# Altium project OAI_KPA_Power_Module.PrjPcb (part 2 of 2)

## Sheet Power module.SchDoc
size 410 x 297 mm
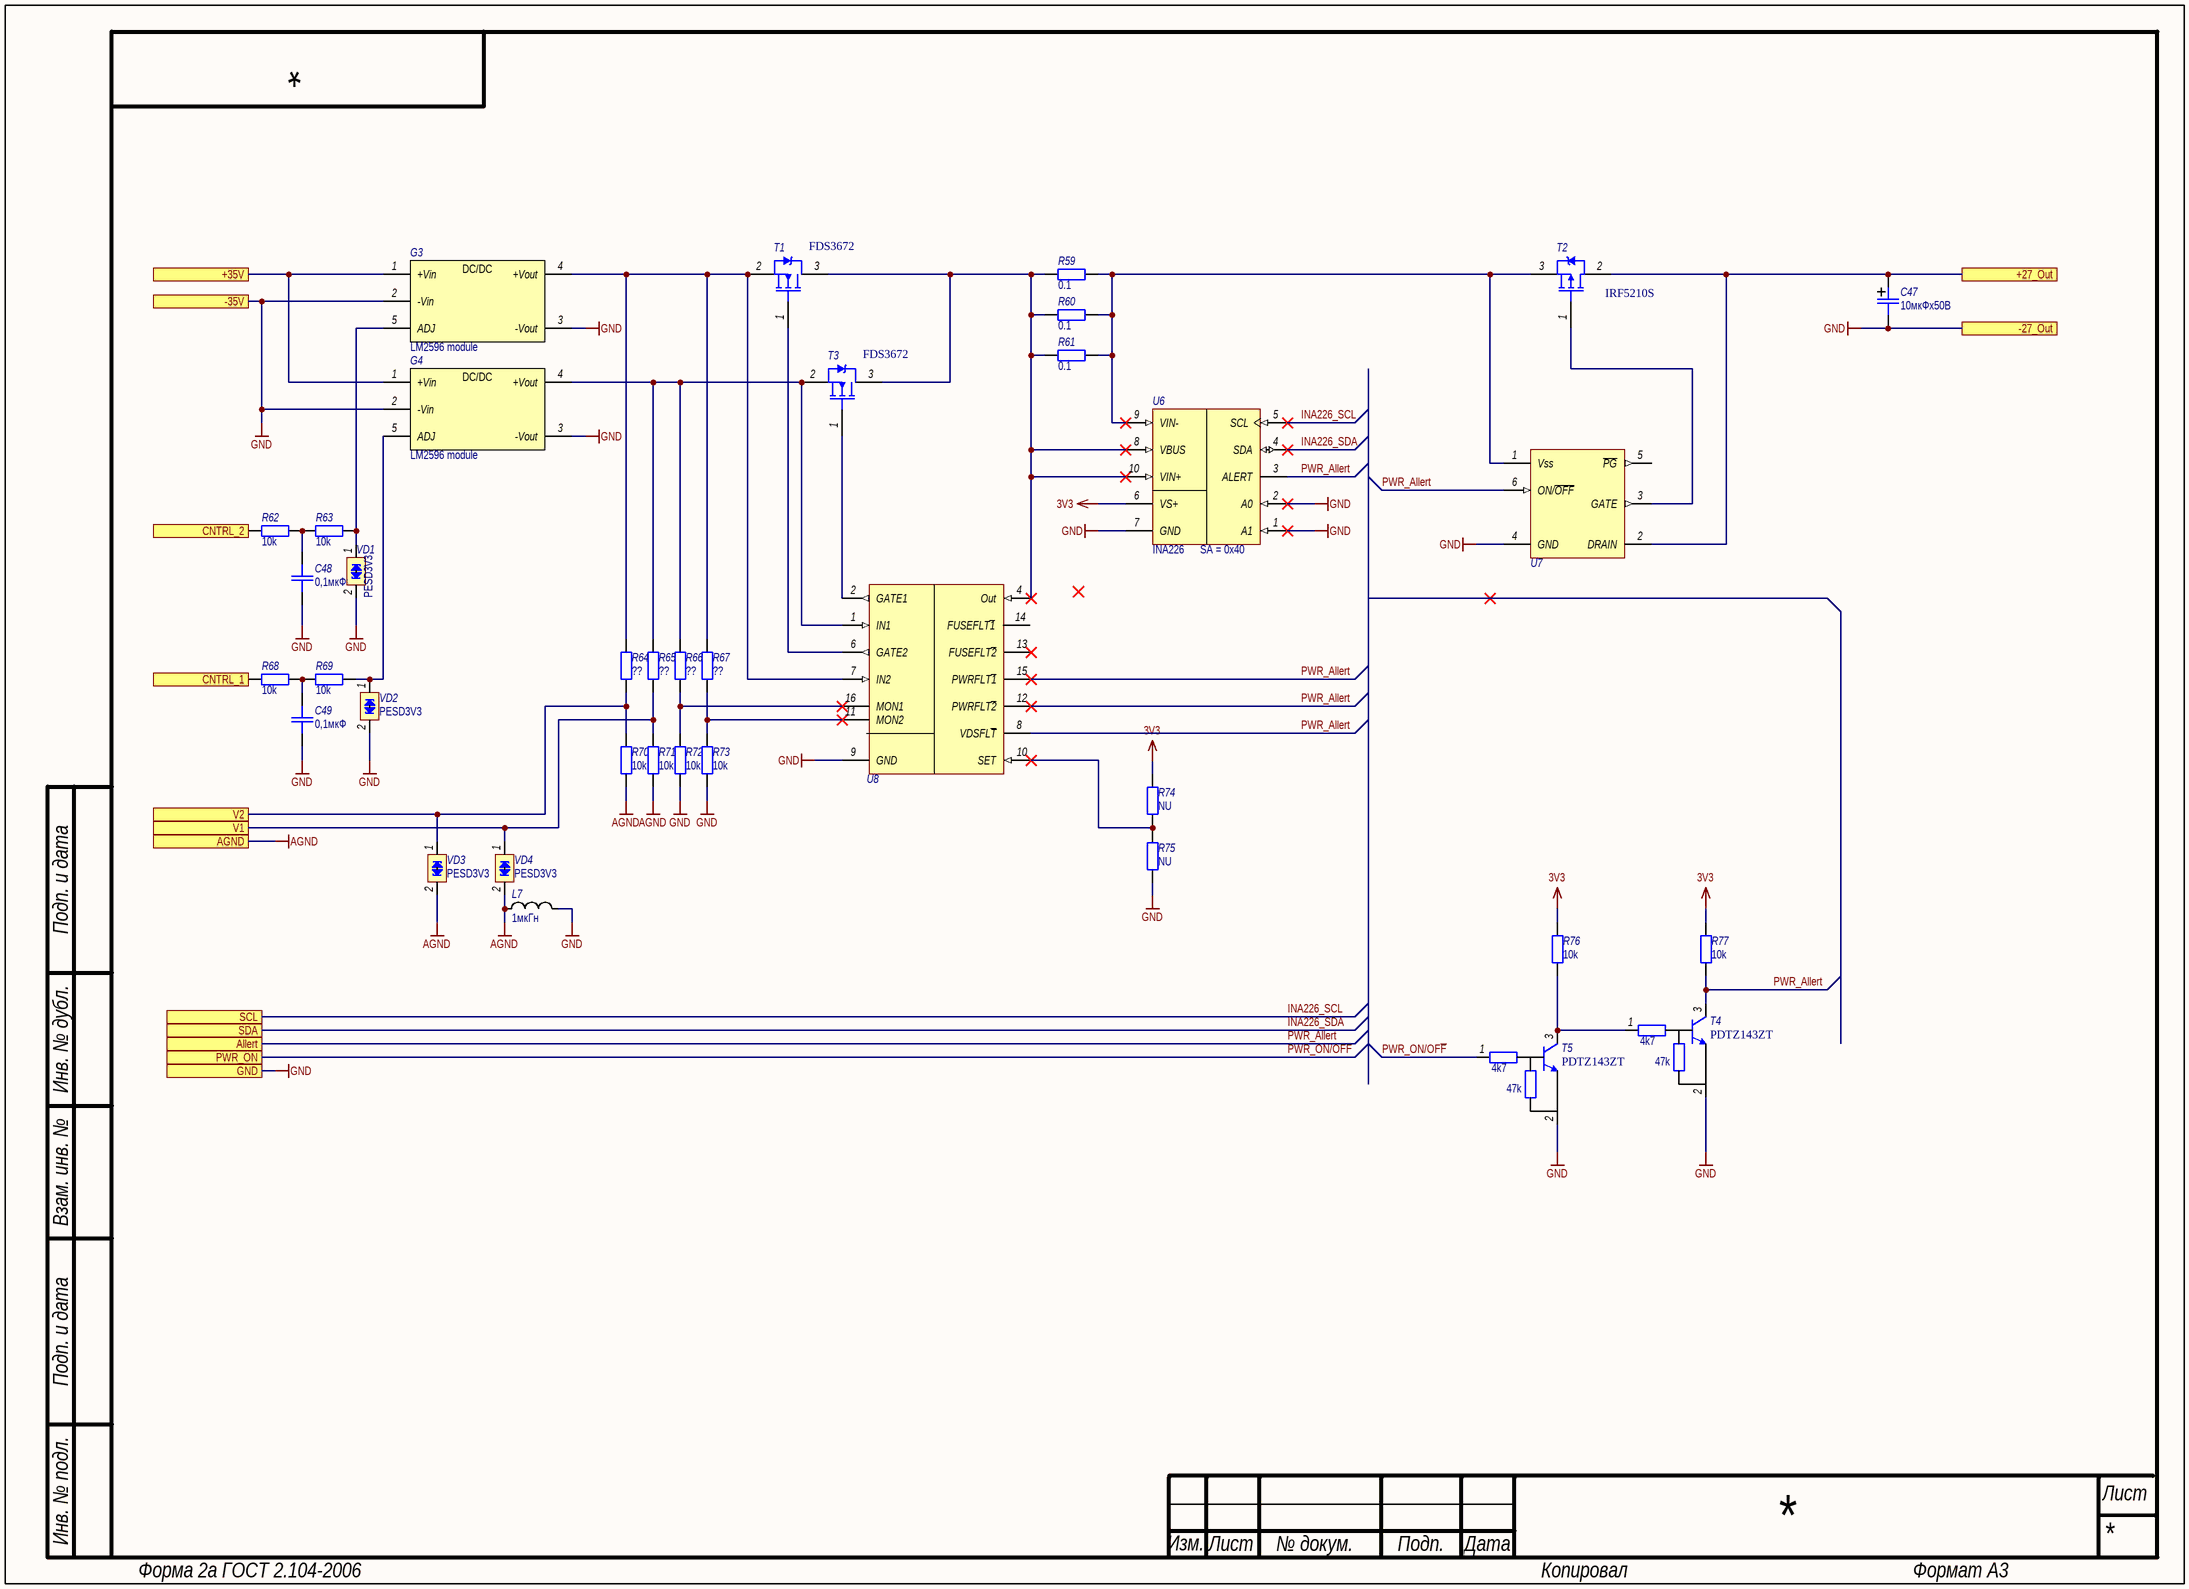
[diagram p8: Power module.SchDoc]

### Parts
C47  10мкФх50В  [SMD_size_C]
C48  0,1мкФ  [SMD_0805]
C49  0,1мкФ  [SMD_0805]
G3  LM2596  [LM2596 module]  (value not drawn)
G4  LM2596  [LM2596 module]  (value not drawn)
L7  1мкГн  [SMD_0805]
R59  0.1  [SMD_0805]
R60  0.1  [SMD_0805]
R61  0.1  [SMD_0805]
R62  10k  [SMD_0805]
R63  10k  [SMD_0805]
R64  ??  [SMD_0805]
R65  ??  [SMD_0805]
R66  ??  [SMD_0805]
R67  ??  [SMD_0805]
R68  10k  [SMD_0805]
R69  10k  [SMD_0805]
R70  10k  [SMD_0805]
R71  10k  [SMD_0805]
R72  10k  [SMD_0805]
R73  10k  [SMD_0805]
R74  NU  [SMD_0805]
R75  NU  [SMD_0805]
R76  10k  [SMD_0805]
R77  10k  [SMD_0805]
T1  FDS3672  [SO-8 Transistor]
T2  IRF5210S  [D2Pak]
T3  FDS3672  [SO-8 Transistor]
T4  PDTZ143ZT  [SOT-23]
T5  PDTZ143ZT  [SOT-23]
U6  INA226  [VSSOP-10]
U7  MAX5902  [SOT23-6]  (value not drawn)
U8  LTC4355  [MSOP16]  (value not drawn)
VD1  PESD3V3  [SOD-323]
VD2  PESD3V3  [SOD-323]
VD3  PESD3V3  [SOD-323]
VD4  PESD3V3  [SOD-323]

### Ports
+27_Out, +35V, -27_Out, -35V, AGND, Allert, CNTRL_1, CNTRL_2, GND, PWR_ON, SCL, SDA, V1, V2

### Nets
3V3: R74.2 R76.2 R77.2 U6.6(VS+)  [project net 3.3V]
AGND: L7.1 R70.1 R71.1 VD3.2(cathode_2) VD4.2(cathode_2) ; port AGND  [project net A_GND]
GND: C47.2 C48.1 C49.1 G3.2(-Vin) G3.3(-Vout) G4.2(-Vin) G4.3(-Vout) L7.2 R72.1 R73.1 R75.1 T4.2(E) T5.2(E) U6.1(A1) U6.2(A0) U6.7(GND) U7.4(GND) U8.9(GND) VD1.2(cathode_2) VD2.2(cathode_2) ; port -35V, port -27_Out, port GND
ADC_IN_1: R65.1 R71.2 VD4.1(cathode_1) ; port V1
ADC_IN_2: R64.1 R70.2 VD3.1(cathode_1) ; port V2
GPIO_7: R68.2 ; port CNTRL_1
GPIO_8: R62.2 ; port CNTRL_2
INA226_SCL: U6.5(SCL) ; port SCL  [project net I2C_CLK]
INA226_SDA: U6.4(SDA) ; port SDA  [project net I2C_DIO]
Power_IN: G3.1(+Vin) G4.1(+Vin) ; port +35V
PWR_+27_out: C47.1 T2.2(D) U7.2(DRAIN) ; port +27_Out
PWR_Allert: R77.1 T4.3(C) U6.3(ALERT) U7.6(ON/~{OFF}) U8.8(VDSFL~{T}) U8.12(PWRFLT~{2}) U8.15(PWRFLT~{1}) ; port Allert  [project net GPIO_2]
PWR_ON/OF~{F}: T5.1(B) ; port PWR_ON  [project net GPIO_1]
NetC48_2: C48.2 R62.1 R63.2
NetC49_2: C49.2 R68.1 R69.2
NetG3_4: G3.4(+Vout) R64.2 R67.2 T1.2(D) U8.7(IN2)
NetG3_5: G3.5(ADJ) R63.1 VD1.1(cathode_1)
NetG4_4: G4.4(+Vout) R65.2 R66.2 T3.2(D) U8.1(IN1)
NetG4_5: G4.5(ADJ) R69.1 VD2.1(cathode_1)
NetR59_1: R59.1 R60.1 R61.1 T2.3(S) U6.9(VIN-) U7.1(Vss)
NetR59_2: R59.2 R60.2 R61.2 T1.3(S) T3.3(S) U6.8(VBUS) U6.10(VIN+) U8.4(Out)
NetR66_1: R66.1 R72.2 U8.16(MON1)
NetR67_1: R67.1 R73.2 U8.11(MON2)
NetR74_1: R74.1 R75.2 U8.10(SET)
NetR76_1: R76.1 T4.1(B) T5.3(C)
NetT1_1: T1.1(G) U8.6(GATE2)
NetT2_1: T2.1(G) U7.3(GATE)
NetT3_1: T3.1(G) U8.2(GATE1)

Not connected (* = marked no-connect by the designer): U7 5(~{PG}); U8 13(FUSEFLT~{2})* 14(FUSEFLT~{1})

### Notes on the sheet
- (near U6) SA = 0x40
- Подп. и дата
- Инв. № дубл.
- Взам. инв. №
- Инв. № подл.
- Изм.
- Лист
- № докум.
- Подп.
- Дата
- Форма 2а ГОСТ 2.104-2006
- Копировал
- Формат А3
- (in symbol LM2596) DC/DC
- (in symbol PDTZ143ZT) 4k7; 47k

### Library data of the parts
C47 = Capacitor_pol: Polarized capacitor; Назначение: Поляризованный SMD-конденсатор; Наименование: Поляризованный конденсатор; Потребление, Вт: 0; Value: 10мкФх50В
C48 C49 = Capacitor: Назначение: SMD-конденсатор; Наименование: Конденсатор; Потребление, Вт: 0; Value: 0,1мкФ
G3 G4 = LM2596: DC/DC converter; Назначение: DC-DC преобразователь; Потребление, Вт: 20; DataSheet: https://static.chipdip.ru/lib/641/DOC001641867.pdf; Наименование: LM2596 module
L7 = Inductor: Наименование: Индуктивность; Назначение: SMD-индуктивность; Потребление, Вт: 0,010; Value: 1мкГн
R59-R77 = Resistor: Наименование: Резистор; Назначение: SMD-резистор; Потребление, Вт: 0,001; Value: 1к
T1 T3 = FDS3672: N channel Power MosFET; Назначение: Транзистор верхнего плеча, для "идеального" диода; Потребление, Вт: 0,025; Наименование: FDS3672
T2 = IRF5210S: P channel Power MosFET; Назначение: Транзистор P канальный; Потребление, Вт: 0,02; Наименование: IRF5210S
T4 T5 = PDTZ143ZT: Digital Transistor; назначение: транзистор; Потребление, Вт: 0,01; Datasheet: https://static.chipdip.ru/lib/583/DOC001583045.pdf; наименование: PDTZ143ZT
U6 = INA226: High- or Low-Side Measurement, Bidirectional Current and Power Monitor With I2C Interface; Назначение: High-Side or Low-Side Measurement,; Потребление, Вт: 0,001; ComponentLink1Description: Data sheet; ComponentLink1URL: http://www.ti.com/lit/ds/symlink/ina226.pdf; DataSheet: https://www.ti.com/lit/ds/symlink/ina226.pdf?ts=1592809211957&ref_url=https%253A%252F%252Fwww.google.com%252F; Наименование: INA226
U7 = MAX5902: Hot-swap controller; Package Information: Latest Revision: ver11.0, Feb-2003; Configures: APEX II, APEX 20K, Mercury, ACEX 1K & FLEX Devices; Code - JEDEC: MS-026-ABA; Назначение: Драйвер верхнего плеча, драйвер P транзистора; Потребление, Вт: 0,01; Published: 17-Sep-2003; Datasheet: Latest Revision: ver1.1, Oct-2003; Package Reference: TQFP32; Publisher: Altium Limited; Наименование: MAX5902
U8 = LTC4355: Ideal Diode; Назначение: Идеальный диод; Потребление, Вт: 0,02; ComponentLink1Description: Data sheet; ComponentLink1URL: http://www.ti.com/lit/ds/symlink/ina226.pdf; DataSheet: https://www.analog.com/media/en/technical-documentation/data-sheets/4355ff.pdf; Наименование: LTC4355
VD1-VD4 = PESDxL1BA: Low capacitance bidirectional ESD protection diodes; Назначение: ESD защитные диоды; Потребление, Вт: 0.0; Наименование: PESDxL1BA

## Nets that join several sheets
2V048: Module_main (X7.9), main (U4.32), power (C20.2 U2.3 U2.4)
3.3V: Module_main (X8.4 X9.3 X9.4), main (40 pins), power (12 pins), Power module (R74.2 R76.2 R77.2 U6.6)
3V3A: main (U4.33), power (C21.2 L1.2 U2.1 U2.2)
+5V: Module_main (X9.7 X9.8), power (R9.2 U1.8 U1.9)
-5V: Module_main (X9.9 X9.10), power (C14.1 C15.2 G1.5)
A_GND: Module_main (X7.10 X8.19 X8.20), main (U4.31), adc (8 pins), dac (C45.1 C46.1), power (C20.1 C21.1 L2.2 U2.5), Power module (5 pins)
GND: Module_main (18 pins), main (39 pins), USB (C40.2 C41.1 U5.9 U5.15), power (24 pins), Functional_Module_main (X12.4 X12.5 X12.6), Power module (20 pins)
USB_GND_IN: main (L3.2 X3.7 X3.8), USB (7 pins)
ADC_IN_1: Module_main (X7.1), adc (R1.2), Power module (R65.1 R71.2 VD4.1)
ADC_IN_2: Module_main (X7.2), adc (R2.2), Power module (R64.1 R70.2 VD3.1)
ADC_IN_3: Module_main (X7.3), adc (R3.2)
ADC_IN_4: Module_main (X7.4), adc (R4.2)
ADC_IN_5: Module_main (X7.5), adc (R5.2)
ADC_IN_6: Module_main (X7.6), adc (R6.2)
ADC_IN_7: Module_main (X7.7), adc (R7.2)
ADC_IN_8: Module_main (X7.8), adc (R8.2)
ADC_MC_IN_1: main (U4.34), adc (C1.2 R1.1)
ADC_MC_IN_2: main (U4.35), adc (C2.2 R2.1)
ADC_MC_IN_3: main (U4.36), adc (C3.2 R3.1)
ADC_MC_IN_4: main (U4.37), adc (C4.2 R4.1)
ADC_MC_IN_5: main (U4.18), adc (C5.2 R5.1)
ADC_MC_IN_6: main (U4.19), adc (C6.2 R6.1)
ADC_MC_IN_7: main (U4.20), adc (C7.2 R7.1)
ADC_MC_IN_8: main (U4.21), adc (C8.2 R8.1)
CAN_RX: Module_main (X8.11), main (R28.2)
CAN_TX: Module_main (X8.12), main (R29.2)
D_IN_3_N: main (U4.103), USB (L6.2)
D_IN_3_P: main (U4.104), USB (L6.3)
DAC_MC_Out_1: main (U4.40), dac (R49.1)
DAC_MC_Out_2: main (U4.41), dac (R50.1)
DAC_OUT_1: Module_main (X8.17), dac (C45.2 R49.2)
DAC_OUT_2: Module_main (X8.18), dac (C46.2 R50.2)
GPIO_1: Module_main (X9.11), GPIO_Shunt (R51.2), Power module (T5.1)
GPIO_2: Module_main (X9.12), GPIO_Shunt (R52.2), Power module (7 pins)
GPIO_3: Module_main (X9.13), GPIO_Shunt (R53.2)
GPIO_4: Module_main (X9.14), GPIO_Shunt (R54.2)
GPIO_5: Module_main (X9.15), GPIO_Shunt (R55.2)
GPIO_6: Module_main (X9.16), GPIO_Shunt (R56.2)
GPIO_7: Module_main (X9.17), GPIO_Shunt (R57.2), Power module (R68.2)
GPIO_8: Module_main (X9.18), GPIO_Shunt (R58.2), Power module (R62.2)
GPIO_CPU_1: main (U4.26), GPIO_Shunt (R51.1)
GPIO_CPU_2: main (U4.27), GPIO_Shunt (R52.1)
GPIO_CPU_3: main (U4.28), GPIO_Shunt (R53.1)
GPIO_CPU_4: main (U4.29), GPIO_Shunt (R54.1)
GPIO_CPU_5: main (U4.44), GPIO_Shunt (R55.1)
GPIO_CPU_6: main (U4.45), GPIO_Shunt (R56.1)
GPIO_CPU_7: main (U4.96), GPIO_Shunt (R57.1)
GPIO_CPU_8: main (U4.97), GPIO_Shunt (R58.1)
I2C_CLK: Module_main (X8.14), main (U4.11), Power module (U6.5)
I2C_DIO: Module_main (X8.13), main (U4.10), Power module (U6.4)
I2C_SCL: main (R35.1 U4.136), power (U1.5 U3.5)
I2C_SDA: main (R34.1 U4.137), power (U1.4 U3.4)
Out_D_1_MB_N: main (X3.3 X3.4), USB (R45.1 X5.2)
Out_D_1_MB_P: main (X3.1 X3.2), USB (R46.1 X6.2)
Power_IN: Module_main (X10.1 X10.2 X10.3 X10.4), main (X3.9 X3.10), power (C9.1 C11.2 G1.1), Power module (G3.1 G4.1)
PWR_+27_out: Functional_Module_main (X12.1 X12.2 X12.3), Power module (C47.1 T2.2 U7.2)
PWR_ALERT: main (U4.7), power (R14.2 U1.3 U3.3)
SPI_CLK: Module_main (X8.8), main (R24.2)
SPI_MISO: Module_main (X8.9), main (R25.2)
SPI_MOSI: Module_main (X8.7), main (R26.2)
UART_1_RX: Module_main (X8.3), main (R23.1)
UART_1_TX: Module_main (X8.5), main (R21.1)
UART_2_RX: Module_main (X8.15), main (R32.2)
UART_2_TX: Module_main (X8.16), main (R31.2)
V_in: main (X3.5 X3.6), USB (C42.2 C44.1 U5.1 X4.1)